# EAGLE board A20-OLINUXINO-MICRO_Rev_K (EAGLE 4.16), part 1 of 7
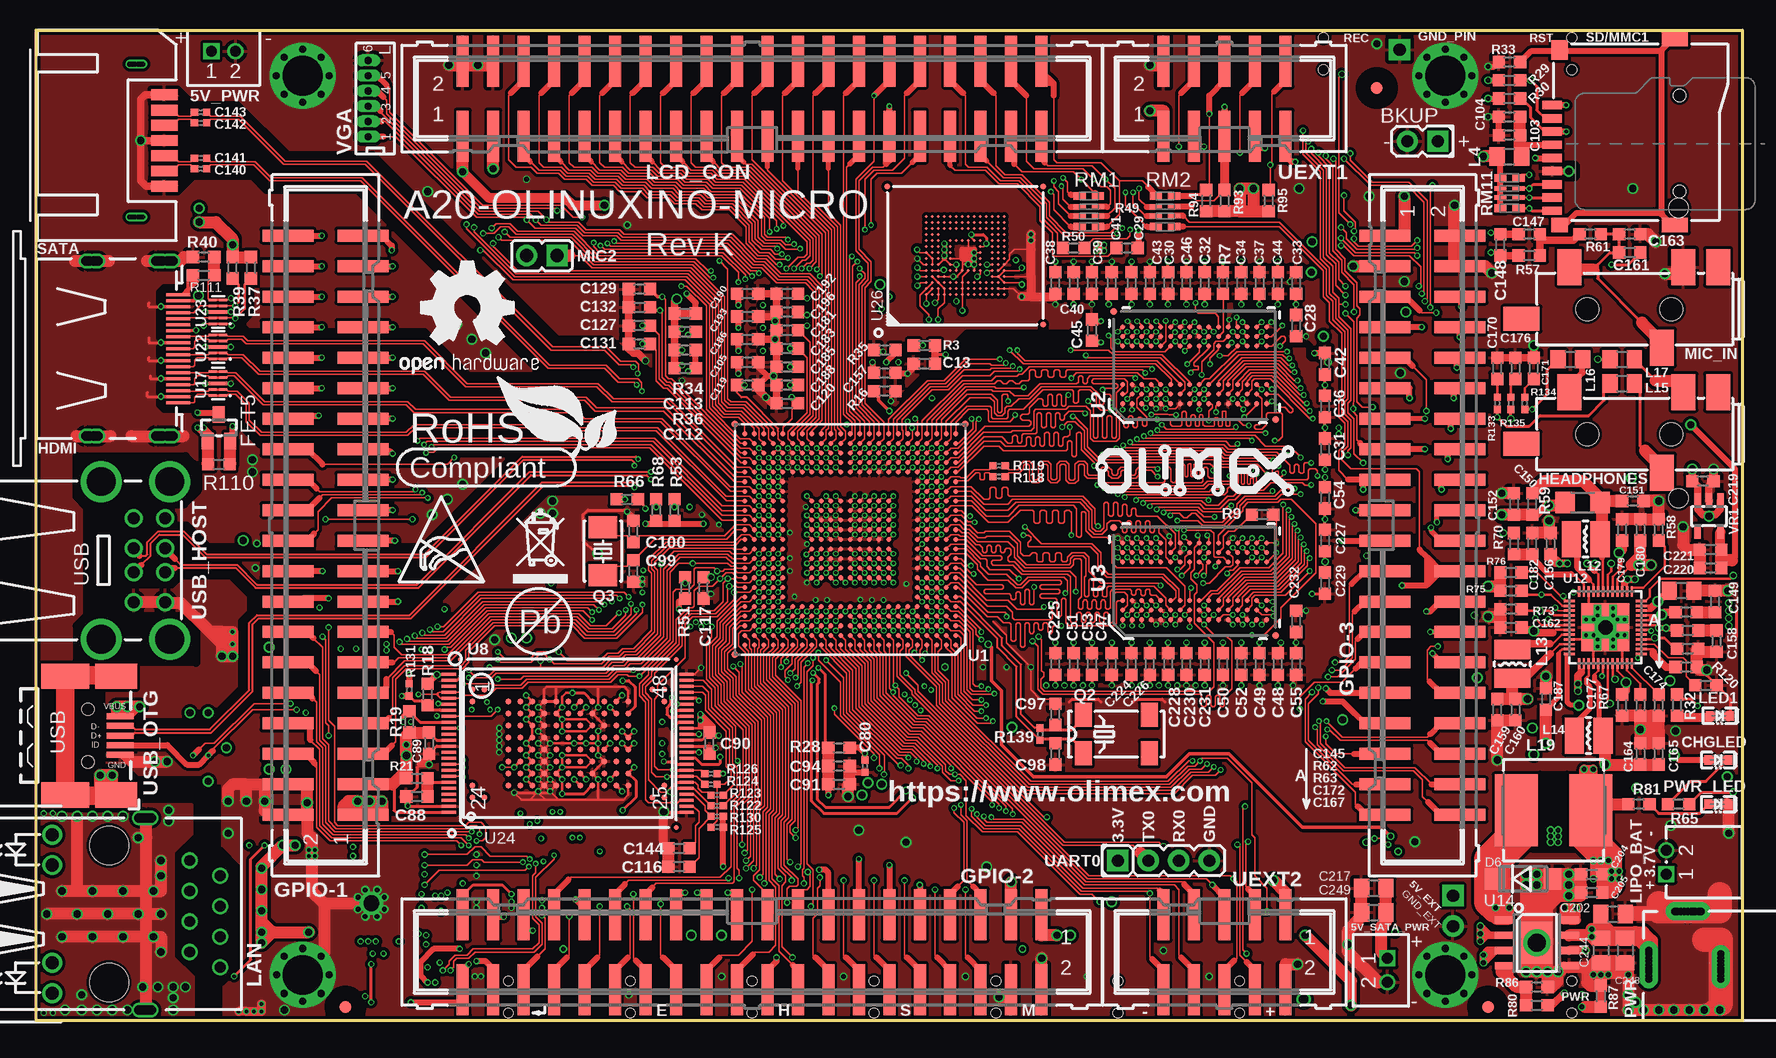
[diagram p5: board, top side]
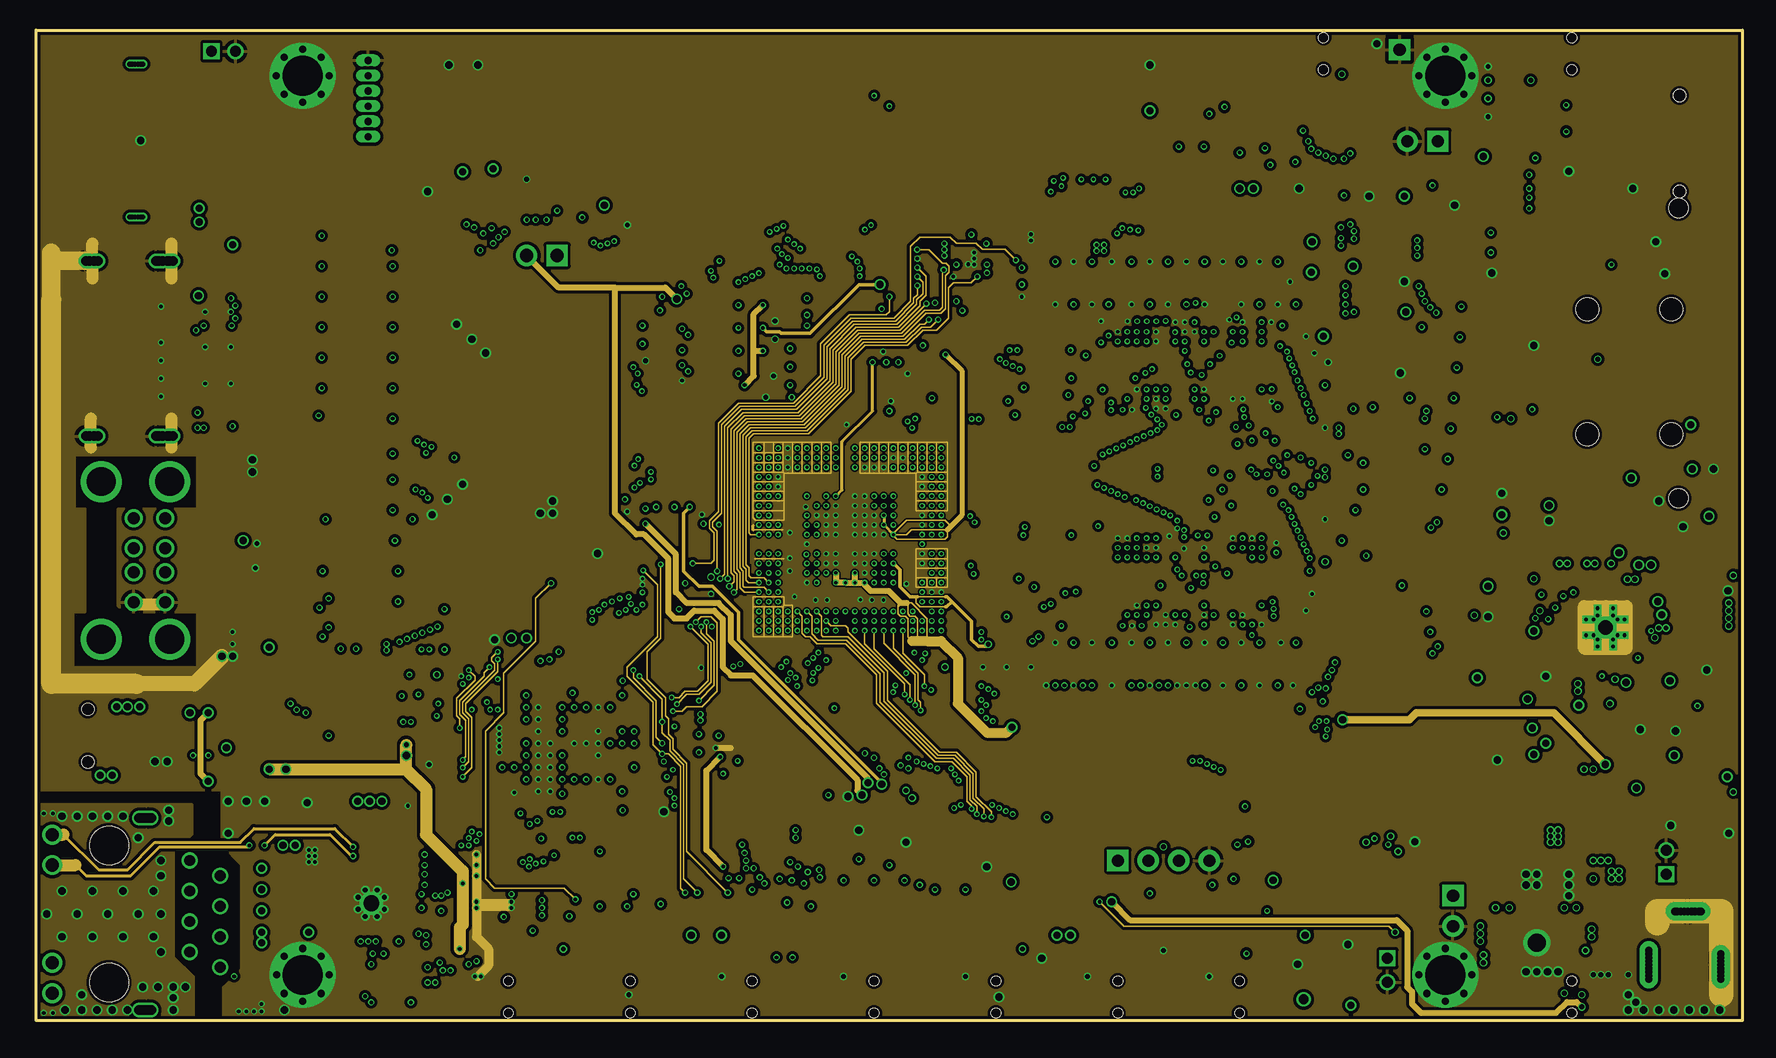
[diagram p6: board, inner layer Route2]
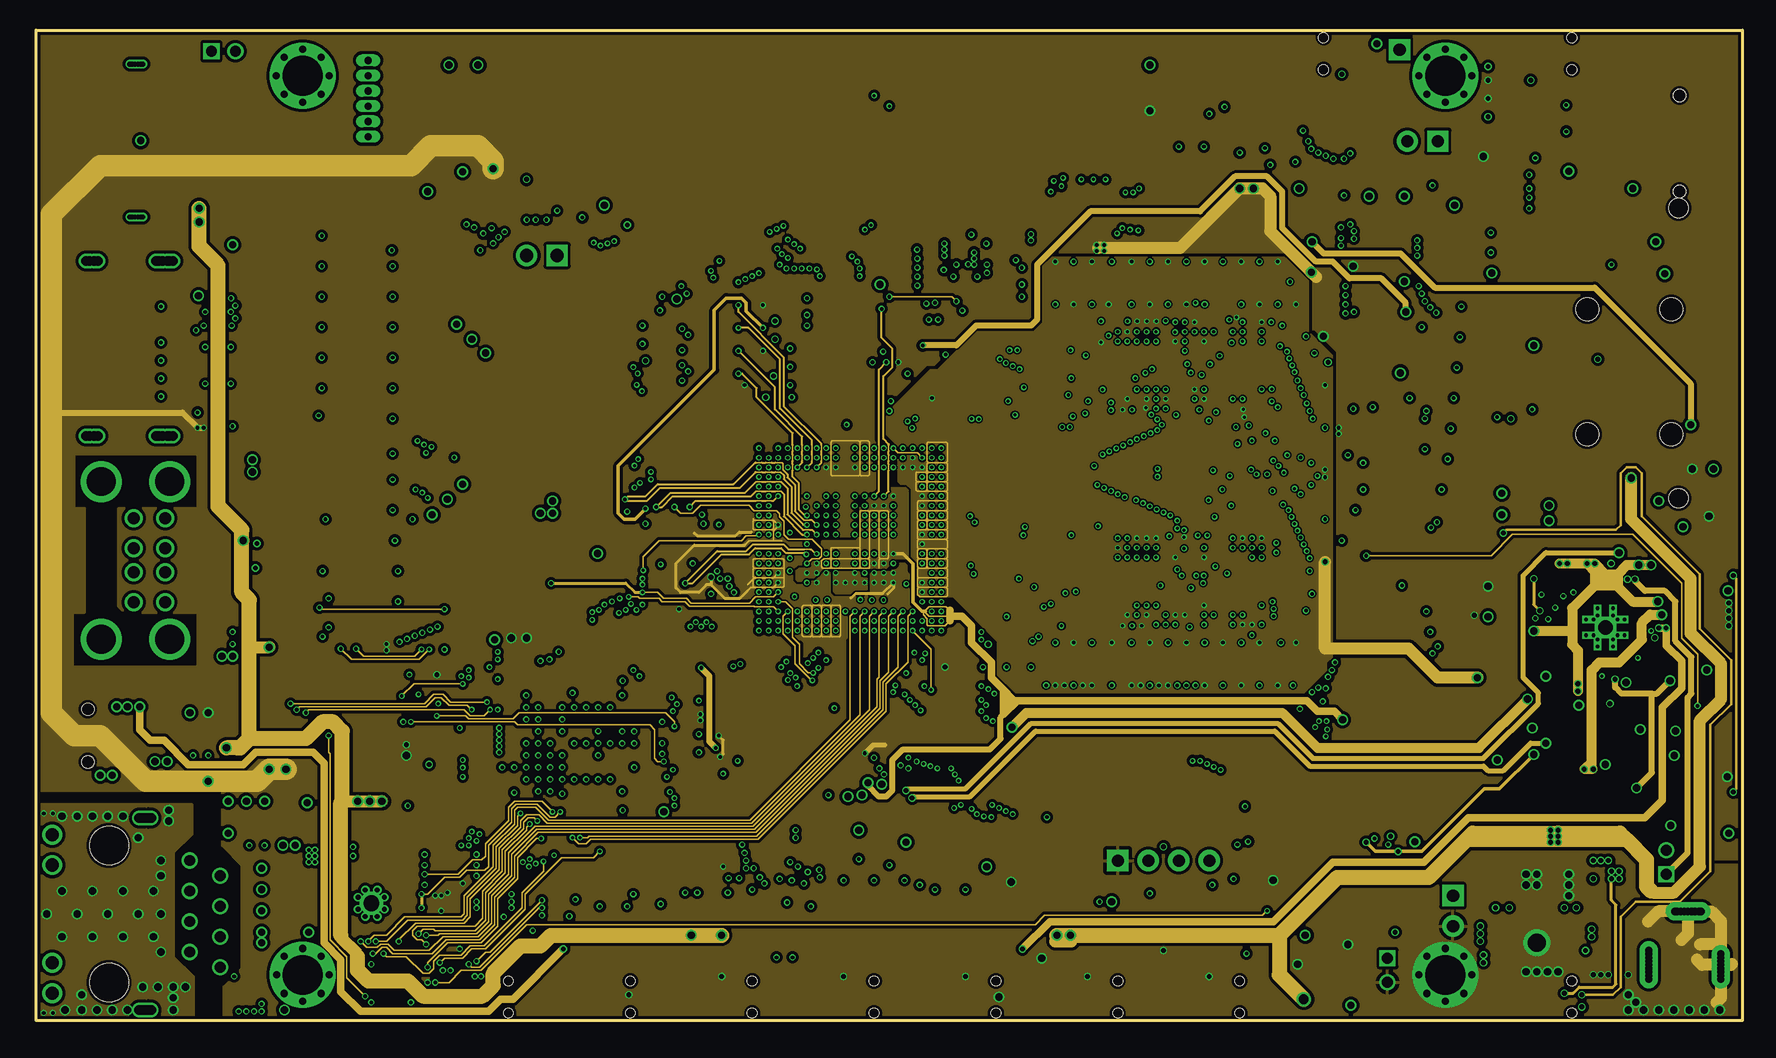
[diagram p7: board, inner layer Route15]
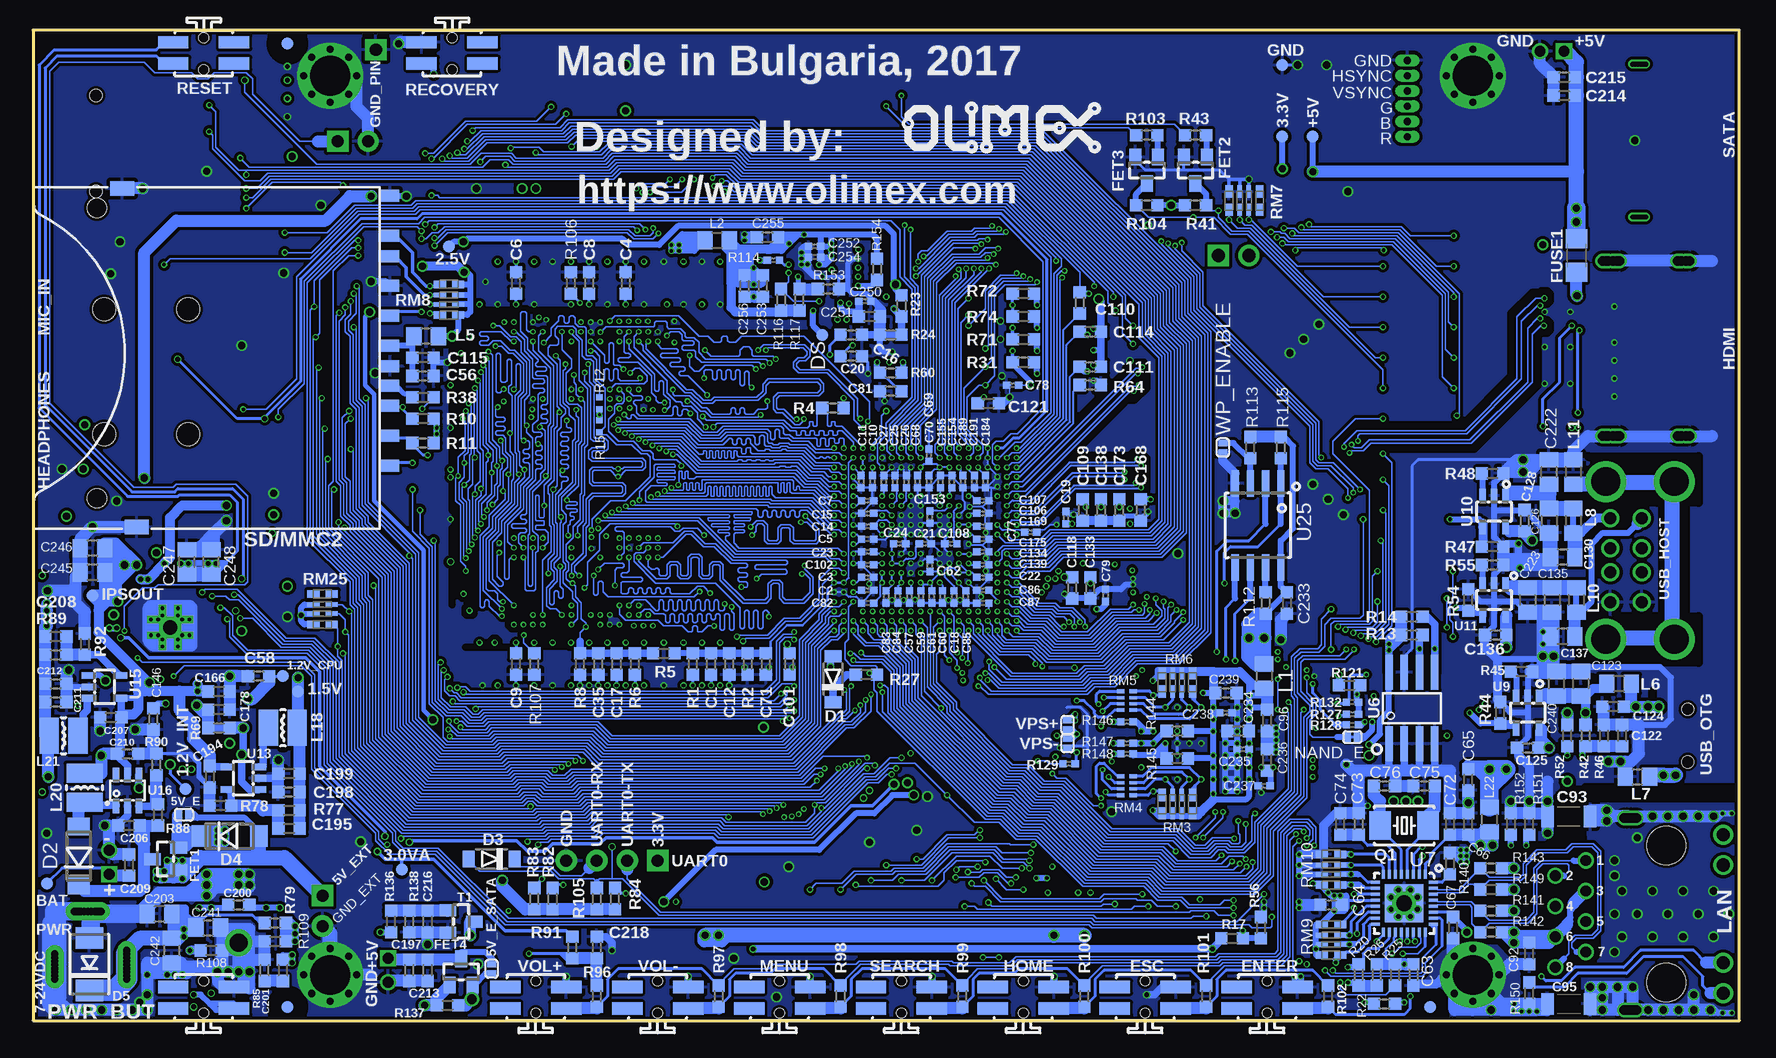
[diagram p8: board, bottom side, seen from below]

Size 142.24 x 82.55 mm. Coordinates in mm from the lower left corner, seen from the top.
Outline: 0,0 0,82.55 142.24,82.55 142.24,0 0,0
Copper layers (1+2*15+16): Top 0.035mm / dielectric 0.127mm / Route2 0.035mm / dielectric 1.1mm / Route15 0.035mm / dielectric 0.127mm / Bottom 0.035mm
Design rules "default": minimum track width 4.5mil, minimum drill 10mil, track to track 5mil, track to pad 5mil, pad to pad 5mil, via to via 5mil, smd to smd 1mil, copper to edge 10mil, drill to drill 8mil, minimum pad ring 6mil, minimum via ring 4mil, stop-mask expansion 4mil, vias tented up to drill 25mil, thermal gap 12mil
tRestrict: 311 lines
bRestrict: 296 lines

## Footprints (pad centres in the part's own frame; a part is rotated, then mirrored left to right if it is on the bottom)
TESTPAD_40-ROUND = smd 1.016 x 1.016: 1 0,0
SJ_1_SMALLER = smd 0.508 x 0.762: 1 -0.381,0; 2 0.381,0
TEST_PAD40/70/SQUARE = drill 1.016 pad 1.778 square: P$1 0,0
DW02S = drill 0.9 square: 1 -1,0 | drill 0.9 round: 2 1,0
HN1X2 = drill 1 pad 1.778 square: 1 -1.27,0 | drill 1 pad 1.778 round: 2 1.27,0
C0603_DWS = smd 1.016 x 1.016: 1 -0.889,0; 2 0.889,0
C0402_TI = smd 0.61 x 0.584: 1 -0.508,0; 2 0.508,0
C1206_5MILS_WS_ISO = smd 1.016 x 1.778: 1 -1.778,0; 2 1.778,0
C0805_5MIL_DWS = smd 1.27 x 1.524: 1 -1.016,0; 2 1.016,0
LED-0603_TEST = smd 0.8 x 0.8: A 0.762,0; C -0.762,0
SOD-123 = smd 1 x 1.4: A 1.9,0; C -1.9,0
MLL-41 = smd 1.45 x 1.8: A 2.445,0; K -2.445,0
DO214AA = smd 1.778 x 2.286: A 2.177,0; C -2.177,0
SW_TAKT3X4 = smd 2.54 x 1.016: 1_1 2.54,-0.889; 1_2 -2.54,-0.889; 2_1 2.54,0.889; 2_2 -2.54,0.889 | hole 0.8: 0,1.397; 0,-1.27
SOT23 = smd 1.4 x 1: 1 1.1,-0.95; 2 1.1,0.95; 3 -1.1,0
1206 = smd 1.6 x 1.8: 1 -1.4,0; 2 1.4,0
TESTPAD = drill 1.016 pad 1.778 round: P$1 0,0
ML40-MALE(GBH-254-SMT-40)_TEST = smd 1 x 4.25: 1 -24.13,-3.125; 2 -24.13,3.125; 3 -21.59,-3.125; 4 -21.59,3.125; 5 -19.05,-3.125; 6 -19.05,3.125; 7 -16.51,-3.125; 8 -16.51,3.125; 9 -13.97,-3.125; 10 -13.97,3.125; 11 -11.43,-3.125; 12 -11.43,3.125; 13 -8.89,-3.125; 14 -8.89,3.125; 15 -6.35,-3.125; 16 -6.35,3.125; 17 -3.81,-3.125; 18 -3.81,3.125; 19 -1.27,-3.125; 20 -1.27,3.125; 21 1.27,-3.125; 22 1.27,3.125; 23 3.81,-3.125; 24 3.81,3.125; 25 6.35,-3.125; 26 6.35,3.125; 27 8.89,-3.125; 28 8.89,3.125; 29 11.43,-3.125; 30 11.43,3.125; 31 13.97,-3.125; 32 13.97,3.125; 33 16.51,-3.125; 34 16.51,3.125; 35 19.05,-3.125; 36 19.05,3.125; 37 21.59,-3.125; 38 21.59,3.125; 39 24.13,-3.125; 40 24.13,3.125
HDMI-SWM-19_TEST = smd 0.25 x 2: 1 -4.5,-5.75; 2 -4,-5.75; 3 -3.5,-5.75; 4 -3,-5.75; 5 -2.5,-5.75; 6 -2,-5.75; 7 -1.5,-5.75; 8 -1,-5.75; 9 -0.5,-5.75; 10 0,-5.75; 11 0.5,-5.75; 12 1,-5.75; 13 1.5,-5.75; 14 2,-5.75; 15 2.5,-5.75; 16 3,-5.75; 17 3.5,-5.75; 18 4,-5.75; 19 4.5,-5.75 | drill 0.8 round: P$5 -7.3,-4.85; P$7 -7.3,1.25; P$9 7.3,1.25; P$11 7.3,-4.85; P$13 -7.3,-4.45; P$15 -7.3,1.65; P$18 7.3,1.65; P$20 7.3,-4.45; P$21 -7.3,-4.15; P$22 -7.3,-5; P$23 7.3,-5; P$24 7.3,-4.15; P$25 -7.3,-5.3; P$26 7.3,-5.3; P$27 7.3,0.95; P$28 -7.275,0.95; SH1 -7.3,-3.9; SH2 -7.3,1.95; SH3 7.3,1.95; SH4 7.3,-3.9
PJ-W47S-05D2-LF_5PIN_V2 = smd 2 x 3: 1 2.1,-0.5; 2 14.5,-0.5; 3 6.8,6.2; 5 5,-0.5 | smd 3 x 2: 4 18.5,3.8 | hole 1.9: 6,3; 13,3
L0805_5MIL_DWS = smd 1.27 x 1.524: 1 -1.016,0; 2 1.016,0
CD32 = smd 1.6 x 3: 1 -1.2,0; 2 1.2,0
8X8MM_3131 = smd 3.6 x 6: 1 -3.1,0; 2 3.1,0
RJLBC-060TC1_MILLING = drill 0.9 round: 1 -4.455,6.7; 2 -3.185,9.24; 3 -1.915,6.7; 4 -0.645,9.24; 5 0.625,6.7; 6 1.895,9.24; 7 3.165,6.7; 8 4.435,9.24 | drill 0.8 round: _1 -8,2.5; _2 -8,2.7; _3 -8,2.9; _4 -8,3.3; _5 -8,3.5; _6 8,3.5; _7 8,3.3; _8 8,2.9; _9 8,2.7; _10 8,2.5; GND1 -8,3.1; GND2 8,3.1 | drill 1.1 round: AG 4.07,-4.748; AY -6.61,-4.748; KG 6.61,-4.748; KY -4.07,-4.748 | hole 3.2: -5.715,0; 5.715,0
DW02R = drill 0.9 square: 1 -1,0 | drill 0.9 round: 2 1,0
JP1 = drill 1.1 pad 1.778 square: 1 0,-1.27 | drill 1.1 pad 1.778 round: 2 0,1.27
SJ_1_SMALLER_CLOSE_10MILS = smd 0.508 x 0.762: 1 -0.381,0; 2 0.381,0
PWR_JACK_UNI_MILLING_SMALLER_DRILLS = drill 0.6 pad 1.5 round: + -0.196,4.75; +1 -0.196,5.05; +2 -0.196,5.35; +3 -0.196,5.65; +4 -0.196,4.45; +5 -0.196,4.15; +6 -0.196,3.85; +7 -0.196,3.55; +8 -0.196,5.95; - -6.196,4.75; -1 -6.196,5.05; -2 -6.196,5.35; -3 -6.196,4.45; -4 -6.196,4.15; -5 -6.196,5.65; -6 -6.196,3.85; -8 -6.196,5.95; -- -3.446,0.3; --1 -3.746,0.3; --2 -4.046,0.3; --3 -4.346,0.3; --4 -3.146,0.3; --5 -2.846,0.3; --6 -2.546,0.3; --14 -4.546,0.3; --15 -2.346,0.3
HCX-4S = smd 1.8 x 2.4: 1 -2,0; 2 2,0
MC-306_TEST = smd 1.4 x 2: 1 -2.75,-1.6; 2 2.75,-1.6; 3 2.75,1.6; 4 -2.75,1.6
R0603_5MIL_DWS = smd 1.016 x 1.016: 1 -0.889,0; 2 0.889,0
R0402_SMALL = smd 0.5 x 0.55: 1 -0.508,0; 2 0.508,0
0603_0R = smd 1.016 x 1.016: 1 -0.889,0; 2 0.889,0
R1206_5MIL_WS = smd 1.651 x 1.778: 1 -1.46,0; 2 1.46,0
R0402_TI = smd 0.61 x 0.584: 1 -0.508,0; 2 0.508,0
R_MATRIX_4 = smd 0.635 x 1.016: 1.1 -1.27,-0.762; 1.2 -1.27,0.762; 4.1 1.27,-0.762; 4.2 1.27,0.762 | smd 0.381 x 1.016: 2.1 -0.381,-0.762; 2.2 -0.381,0.762; 3.1 0.381,-0.762; 3.2 0.381,0.762
R_MATRIX_4_0402_25X625 = smd 0.325 x 0.625: 1.1 -0.79,-0.512; 1.2 -0.79,0.512; 4.1 0.79,-0.512; 4.2 0.79,0.512 | smd 0.25 x 0.625: 2.1 -0.25,-0.512; 2.2 -0.25,0.512; 3.1 0.25,-0.512; 3.2 0.25,0.512
SATA-PWA-07-TEST = smd 0.9 x 2.2: 1 -4.25,-4.8; 2 -2.98,-4.8; 3 -1.71,-4.8; 4 -0.44,-4.8; 5 0.83,-4.8; 6 2.1,-4.8; 7 3.37,-4.8 | drill 0.4 round: P$1 -6.81,-2.35; P$2 -6.81,-2.125; P$3 -6.81,-2.6; P$4 -6.81,-1.925; P$5 -6.81,-3.025; P$11 5.93,-2.35; P$20 5.93,-2.125; P$23 5.93,-2.6; P$24 5.93,-1.925; P$26 5.93,-3.025; SH1 -6.81,-2.825; SH4 5.93,-2.825
TFC-WPAPR-08_BIGGER_CREAM = smd 1.6 x 0.7: 1 -6.994,2.25; 2 -6.994,1.15; 3 -6.994,0.05; 4 -6.994,-1.05; 5 -6.994,-2.15; 6 -6.994,-3.25; 7 -6.994,-4.35; 8 -6.994,-5.45; 9 -6.994,-6.55 | smd 1.4 x 1.2: 10 -6.369,-7.75 | smd 1.4 x 1.6: 11 -6.369,6.85 | smd 2.2 x 1.2: 12 3.231,-7.75; 13 3.231,7.75 | hole 1: 3.631,-4.95; 3.631,3.05
SD_CARD = smd 1.5 x 1: 1 -15.3,6.48; 2 -15.3,3.98; 3 -15.3,0.68; 4 -15.3,-1.03; 5 -15.3,-3.53; 6 -15.3,-6.03; 7 -15.3,-8.46; 8 -15.3,-10.16; 9 -15.3,8.98; CD -15.3,2.33; WP -15.3,-13.51 | smd 2 x 1.2: SH1 7.05,-14.1; SH2 5.85,14.1 | hole 1.6: 9.15,-12.49; 9.15,11.7
TFBGA441 = smd 0.4 x 0.4: A1 -8.8,-8.8; A2 -8.8,-8; A3 -8.8,-7.2; A4 -8.8,-6.4; A5 -8.8,-5.6; A6 -8.8,-4.8; A7 -8.8,-4; A8 -8.8,-3.2; A9 -8.8,-2.4; A10 -8.8,-1.6; A11 -8.8,-0.8; A12 -8.8,0; A13 -8.8,0.8; A14 -8.8,1.6; A15 -8.8,2.4; A16 -8.8,3.2; A17 -8.8,4; A18 -8.8,4.8; A19 -8.8,5.6; A20 -8.8,6.4; A21 -8.8,7.2; A22 -8.8,8; A23 -8.8,8.8; AA1 7.2,-8.8; AA2 7.2,-8; AA3 7.2,-7.2; AA4 7.2,-6.4; AA5 7.2,-5.6; AA6 7.2,-4.8; AA7 7.2,-4; AA8 7.2,-3.2; AA9 7.2,-2.4; AA10 7.2,-1.6; AA11 7.2,-0.8; AA12 7.2,0; AA13 7.2,0.8; AA14 7.2,1.6; AA15 7.2,2.4; AA16 7.2,3.2; AA17 7.2,4; AA18 7.2,4.8; AA19 7.2,5.6; AA20 7.2,6.4; AA21 7.2,7.2; AA22 7.2,8; AA23 7.2,8.8; AB1 8,-8.8; AB2 8,-8; AB3 8,-7.2; AB4 8,-6.4; AB5 8,-5.6; AB6 8,-4.8; AB7 8,-4; AB8 8,-3.2; AB9 8,-2.4; AB10 8,-1.6; AB11 8,-0.8; AB12 8,0; AB13 8,0.8; AB14 8,1.6; AB15 8,2.4; AB16 8,3.2; AB17 8,4; AB18 8,4.8; AB19 8,5.6; AB20 8,6.4; AB21 8,7.2; AB22 8,8; AB23 8,8.8; AC1 8.8,-8.8; AC2 8.8,-8; AC3 8.8,-7.2; AC4 8.8,-6.4; AC5 8.8,-5.6; AC6 8.8,-4.8; AC7 8.8,-4; AC8 8.8,-3.2; AC9 8.8,-2.4; AC10 8.8,-1.6; AC11 8.8,-0.8; AC12 8.8,0; AC13 8.8,0.8; AC14 8.8,1.6; AC15 8.8,2.4; AC16 8.8,3.2; AC17 8.8,4; AC18 8.8,4.8; AC19 8.8,5.6; AC20 8.8,6.4; AC21 8.8,7.2; AC22 8.8,8; AC23 8.8,8.8; B1 -8,-8.8; B2 -8,-8; B3 -8,-7.2; B4 -8,-6.4; B5 -8,-5.6; B6 -8,-4.8; B7 -8,-4; B8 -8,-3.2; B9 -8,-2.4; B10 -8,-1.6; B11 -8,-0.8; B12 -8,0; B13 -8,0.8; B14 -8,1.6; B15 -8,2.4; B16 -8,3.2; B17 -8,4; B18 -8,4.8; B19 -8,5.6; B20 -8,6.4; B21 -8,7.2; B22 -8,8; B23 -8,8.8; C1 -7.2,-8.8; C2 -7.2,-8; C3 -7.2,-7.2; C4 -7.2,-6.4; C5 -7.2,-5.6; C6 -7.2,-4.8; C7 -7.2,-4; C8 -7.2,-3.2; C9 -7.2,-2.4; C10 -7.2,-1.6; C11 -7.2,-0.8; C12 -7.2,0; C13 -7.2,0.8; C14 -7.2,1.6; C15 -7.2,2.4; C16 -7.2,3.2; C17 -7.2,4; C18 -7.2,4.8; C19 -7.2,5.6; C20 -7.2,6.4; C21 -7.2,7.2; C22 -7.2,8; C23 -7.2,8.8; D1 -6.4,-8.8; D2 -6.4,-8; D3 -6.4,-7.2; D4 -6.4,-6.4; D5 -6.4,-5.6; D6 -6.4,-4.8; D7 -6.4,-4; D8 -6.4,-3.2; D9 -6.4,-2.4; D10 -6.4,-1.6; D11 -6.4,-0.8; D12 -6.4,0; D13 -6.4,0.8; D14 -6.4,1.6; D15 -6.4,2.4; D16 -6.4,3.2; D17 -6.4,4; D18 -6.4,4.8; D19 -6.4,5.6; D20 -6.4,6.4; D21 -6.4,7.2; D22 -6.4,8; D23 -6.4,8.8; E1 -5.6,-8.8; E2 -5.6,-8; E3 -5.6,-7.2; E4 -5.6,-6.4; E5 -5.6,-5.6; E6 -5.6,-4.8; E7 -5.6,-4; E8 -5.6,-3.2; E9 -5.6,-2.4; E10 -5.6,-1.6; E11 -5.6,-0.8; E12 -5.6,0; E13 -5.6,0.8; E14 -5.6,1.6; E15 -5.6,2.4; E16 -5.6,3.2; E17 -5.6,4; E18 -5.6,4.8; E19 -5.6,5.6; E20 -5.6,6.4; E21 -5.6,7.2; E22 -5.6,8; E23 -5.6,8.8; F1 -4.8,-8.8; F2 -4.8,-8; F3 -4.8,-7.2; F4 -4.8,-6.4; F5 -4.8,-5.6; F19 -4.8,5.6; F20 -4.8,6.4; F21 -4.8,7.2; F22 -4.8,8; F23 -4.8,8.8; G1 -4,-8.8; G2 -4,-8; G3 -4,-7.2; G4 -4,-6.4; G5 -4,-5.6; G19 -4,5.6; G20 -4,6.4; G21 -4,7.2; G22 -4,8; G23 -4,8.8; H1 -3.2,-8.8; H2 -3.2,-8; H3 -3.2,-7.2; H4 -3.2,-6.4; H5 -3.2,-5.6; H8 -3.2,-3.2; H9 -3.2,-2.4; H10 -3.2,-1.6; H11 -3.2,-0.8; H12 -3.2,0; H13 -3.2,0.8; H14 -3.2,1.6; H15 -3.2,2.4; H16 -3.2,3.2; H19 -3.2,5.6; H20 -3.2,6.4; H21 -3.2,7.2; H22 -3.2,8; H23 -3.2,8.8; J1 -2.4,-8.8; J2 -2.4,-8; J3 -2.4,-7.2; J4 -2.4,-6.4; J5 -2.4,-5.6; J8 -2.4,-3.2; J9 -2.4,-2.4; J10 -2.4,-1.6; J11 -2.4,-0.8; J12 -2.4,0; J13 -2.4,0.8; J14 -2.4,1.6; J15 -2.4,2.4; J16 -2.4,3.2; J19 -2.4,5.6; J20 -2.4,6.4; J21 -2.4,7.2; J22 -2.4,8; J23 -2.4,8.8; K1 -1.6,-8.8; K2 -1.6,-8; K3 -1.6,-7.2; K4 -1.6,-6.4; K5 -1.6,-5.6; K8 -1.6,-3.2; K9 -1.6,-2.4; K10 -1.6,-1.6; K11 -1.6,-0.8; K12 -1.6,0; K13 -1.6,0.8; K14 -1.6,1.6; K15 -1.6,2.4; K16 -1.6,3.2; K19 -1.6,5.6; K20 -1.6,6.4; K21 -1.6,7.2; K22 -1.6,8; K23 -1.6,8.8; L1 -0.8,-8.8; L2 -0.8,-8; L3 -0.8,-7.2; L4 -0.8,-6.4; L5 -0.8,-5.6; L8 -0.8,-3.2; L9 -0.8,-2.4; L10 -0.8,-1.6; L11 -0.8,-0.8; L12 -0.8,0; L13 -0.8,0.8; L14 -0.8,1.6; L15 -0.8,2.4; L16 -0.8,3.2; L19 -0.8,5.6; L20 -0.8,6.4; L21 -0.8,7.2; L22 -0.8,8; L23 -0.8,8.8; M1 0,-8.8; M2 0,-8; M3 0,-7.2; M4 0,-6.4; M5 0,-5.6; M8 0,-3.2; M9 0,-2.4; M10 0,-1.6; M11 0,-0.8; M12 0,0; M13 0,0.8; M14 0,1.6; M15 0,2.4; M16 0,3.2; M19 0,5.6; M20 0,6.4; M21 0,7.2; M22 0,8; M23 0,8.8; N1 0.8,-8.8; N2 0.8,-8; N3 0.8,-7.2; N4 0.8,-6.4; N5 0.8,-5.6; N8 0.8,-3.2; N9 0.8,-2.4; N10 0.8,-1.6; N11 0.8,-0.8; N12 0.8,0; N13 0.8,0.8; N14 0.8,1.6; N15 0.8,2.4; N16 0.8,3.2; N19 0.8,5.6; N20 0.8,6.4; N21 0.8,7.2; N22 0.8,8; N23 0.8,8.8; P1 1.6,-8.8; P2 1.6,-8; P3 1.6,-7.2; P4 1.6,-6.4; P5 1.6,-5.6; P8 1.6,-3.2; P9 1.6,-2.4; P10 1.6,-1.6; P11 1.6,-0.8; P12 1.6,0; P13 1.6,0.8; P14 1.6,1.6; P15 1.6,2.4; P16 1.6,3.2; P19 1.6,5.6; P20 1.6,6.4; P21 1.6,7.2; P22 1.6,8; P23 1.6,8.8; R1 2.4,-8.8; R2 2.4,-8; R3 2.4,-7.2; R4 2.4,-6.4; R5 2.4,-5.6; R8 2.4,-3.2; R9 2.4,-2.4; R10 2.4,-1.6; R11 2.4,-0.8; R12 2.4,0; R13 2.4,0.8; R14 2.4,1.6; R15 2.4,2.4; R16 2.4,3.2; R19 2.4,5.6; R20 2.4,6.4; R21 2.4,7.2; R22 2.4,8; R23 2.4,8.8; T1 3.2,-8.8; T2 3.2,-8; T3 3.2,-7.2; T4 3.2,-6.4; T5 3.2,-5.6; T8 3.2,-3.2; T9 3.2,-2.4; T10 3.2,-1.6; T11 3.2,-0.8; T12 3.2,0; T13 3.2,0.8; T14 3.2,1.6; T15 3.2,2.4; T16 3.2,3.2; T19 3.2,5.6; T20 3.2,6.4; T21 3.2,7.2; T22 3.2,8; T23 3.2,8.8; U1 4,-8.8; U2 4,-8; U3 4,-7.2; U4 4,-6.4; U5 4,-5.6; U19 4,5.6; U20 4,6.4; U21 4,7.2; U22 4,8; U23 4,8.8; V1 4.8,-8.8; V2 4.8,-8; V3 4.8,-7.2; V4 4.8,-6.4; V5 4.8,-5.6; V19 4.8,5.6; V20 4.8,6.4; V21 4.8,7.2; V22 4.8,8; V23 4.8,8.8; W1 5.6,-8.8; W2 5.6,-8; W3 5.6,-7.2; W4 5.6,-6.4; W5 5.6,-5.6; W6 5.6,-4.8; W7 5.6,-4; W8 5.6,-3.2; W9 5.6,-2.4; W10 5.6,-1.6; W11 5.6,-0.8; W12 5.6,0; W13 5.6,0.8; W14 5.6,1.6; W15 5.6,2.4; W16 5.6,3.2; W17 5.6,4; W18 5.6,4.8; W19 5.6,5.6; W20 5.6,6.4; W21 5.6,7.2; W22 5.6,8; W23 5.6,8.8; Y1 6.4,-8.8; Y2 6.4,-8; Y3 6.4,-7.2; Y4 6.4,-6.4; Y5 6.4,-5.6; Y6 6.4,-4.8; Y7 6.4,-4; Y8 6.4,-3.2; Y9 6.4,-2.4; Y10 6.4,-1.6; Y11 6.4,-0.8; Y12 6.4,0; Y13 6.4,0.8; Y14 6.4,1.6; Y15 6.4,2.4; Y16 6.4,3.2; Y17 6.4,4; Y18 6.4,4.8; Y19 6.4,5.6; Y20 6.4,6.4; Y21 6.4,7.2; Y22 6.4,8; Y23 6.4,8.8 | smd 0.6 x 0.6: FID1 -9.6,9.6; FID2 9.6,9.6; FID3 9.6,-9.6
FBGA96_MEM = smd 0.4 x 0.4: A1 -6,-3.2; A2 -6,-2.4; A3 -6,-1.6; A7 -6,1.6; A8 -6,2.4; A9 -6,3.2; B1 -5.2,-3.2; B2 -5.2,-2.4; B3 -5.2,-1.6; B7 -5.2,1.6; B8 -5.2,2.4; B9 -5.2,3.2; C1 -4.4,-3.2; C2 -4.4,-2.4; C3 -4.4,-1.6; C7 -4.4,1.6; C8 -4.4,2.4; C9 -4.4,3.2; D1 -3.6,-3.2; D2 -3.6,-2.4; D3 -3.6,-1.6; D7 -3.6,1.6; D8 -3.6,2.4; D9 -3.6,3.2; E1 -2.8,-3.2; E2 -2.8,-2.4; E3 -2.8,-1.6; E7 -2.8,1.6; E8 -2.8,2.4; E9 -2.8,3.2; F1 -2,-3.2; F2 -2,-2.4; F3 -2,-1.6; F7 -2,1.6; F8 -2,2.4; F9 -2,3.2; G1 -1.2,-3.2; G2 -1.2,-2.4; G3 -1.2,-1.6; G7 -1.2,1.6; G8 -1.2,2.4; G9 -1.2,3.2; H1 -0.4,-3.2; H2 -0.4,-2.4; H3 -0.4,-1.6; H7 -0.4,1.6; H8 -0.4,2.4; H9 -0.4,3.2; J1 0.4,-3.2; J2 0.4,-2.4; J3 0.4,-1.6; J7 0.4,1.6; J8 0.4,2.4; J9 0.4,3.2; K1 1.2,-3.2; K2 1.2,-2.4; K3 1.2,-1.6; K7 1.2,1.6; K8 1.2,2.4; K9 1.2,3.2; L1 2,-3.2; L2 2,-2.4; L3 2,-1.6; L7 2,1.6; L8 2,2.4; L9 2,3.2; M1 2.8,-3.2; M2 2.8,-2.4; M3 2.8,-1.6; M7 2.8,1.6; M8 2.8,2.4; M9 2.8,3.2; N1 3.6,-3.2; N2 3.6,-2.4; N3 3.6,-1.6; N7 3.6,1.6; N8 3.6,2.4; N9 3.6,3.2; P1 4.4,-3.2; P2 4.4,-2.4; P3 4.4,-1.6; P7 4.4,1.6; P8 4.4,2.4; P9 4.4,3.2; R1 5.2,-3.2; R2 5.2,-2.4; R3 5.2,-1.6; R7 5.2,1.6; R8 5.2,2.4; R9 5.2,3.2; T1 6,-3.2; T2 6,-2.4; T3 6,-1.6; T7 6,1.6; T8 6,2.4; T9 6,3.2 | smd 0.6 x 0.6: FID1 6.75,-4.5; FID2 -6.75,4.5
FIDUCIAL-1X3 = smd 1 x 1: 1 0,0
SO-08MN = smd 0.61 x 2.921: 1 -1.905,-2.981; 2 -0.635,-2.981; 3 0.635,-2.981; 4 1.905,-2.981; 5 1.905,2.981; 6 0.635,2.981; 7 -0.635,2.981; 8 -1.905,2.981
QFN-32(DRILLS) = smd 0.25 x 0.75: 1 -1.75,-2.425; 2 -1.25,-2.425; 3 -0.75,-2.425; 4 -0.25,-2.425; 5 0.25,-2.425; 6 0.75,-2.425; 7 1.25,-2.425; 8 1.75,-2.425; 17 1.75,2.425; 18 1.25,2.425; 19 0.75,2.425; 20 0.25,2.425; 21 -0.25,2.425; 22 -0.75,2.425; 23 -1.25,2.425; 24 -1.75,2.425 | smd 0.75 x 0.25: 9 2.425,-1.75; 10 2.425,-1.25; 11 2.425,-0.75; 12 2.425,-0.25; 13 2.425,0.25; 14 2.425,0.75; 15 2.425,1.25; 16 2.425,1.75; 25 -2.425,1.75; 26 -2.425,1.25; 27 -2.425,0.75; 28 -2.425,0.25; 29 -2.425,-0.25; 30 -2.425,-0.75; 31 -2.425,-1.25; 32 -2.425,-1.75 | drill 1.3 round: EP1 0,0 | drill 0.4 round: EP2 -0.5,1.1; EP3 0.5,1.1; EP4 1.1,0.5; EP5 1.1,-0.5; EP6 0.5,-1.1; EP7 -0.5,-1.1; EP8 -1.1,-0.5; EP9 -1.1,0.5 | smd 3.2 x 3.2: EXP_PAD 0,0
TSOP48 = smd 1.2 x 0.25: 1 -9.9,5.75; 2 -9.9,5.25; 3 -9.9,4.75; 4 -9.9,4.25; 5 -9.9,3.75; 6 -9.9,3.25; 7 -9.9,2.75; 8 -9.9,2.25; 9 -9.9,1.75; 10 -9.9,1.25; 11 -9.9,0.75; 12 -9.9,0.25; 13 -9.9,-0.25; 14 -9.9,-0.75; 15 -9.9,-1.25; 16 -9.9,-1.75; 17 -9.9,-2.25; 18 -9.9,-2.75; 19 -9.9,-3.25; 20 -9.9,-3.75; 21 -9.9,-4.25; 22 -9.9,-4.75; 23 -9.9,-5.25; 24 -9.9,-5.75; 25 9.9,-5.75; 26 9.9,-5.25; 27 9.9,-4.75; 28 9.9,-4.25; 29 9.9,-3.75; 30 9.9,-3.25; 31 9.9,-2.75; 32 9.9,-2.25; 33 9.9,-1.75; 34 9.9,-1.25; 35 9.9,-0.75; 36 9.9,-0.25; 37 9.9,0.25; 38 9.9,0.75; 39 9.9,1.25; 40 9.9,1.75; 41 9.9,2.25; 42 9.9,2.75; 43 9.9,3.25; 44 9.9,3.75; 45 9.9,4.25; 46 9.9,4.75; 47 9.9,5.25; 48 9.9,5.75
SOT23-5 = smd 1.2 x 0.55: 1 1.3,-0.95; 2 1.3,0; 3 1.3,0.95; 4 -1.3,0.95; 5 -1.3,-0.95
QFN48 = smd 0.2 x 0.9: 1 -2.2,-3; 2 -1.8,-3; 3 -1.4,-3; 4 -1,-3; 5 -0.6,-3; 6 -0.2,-3; 7 0.2,-3; 8 0.6,-3; 9 1,-3; 10 1.4,-3; 11 1.8,-3; 12 2.2,-3; 25 2.2,3; 26 1.8,3; 27 1.4,3; 28 1,3; 29 0.6,3; 30 0.2,3; 31 -0.2,3; 32 -0.6,3; 33 -1,3; 34 -1.4,3; 35 -1.8,3; 36 -2.2,3 | smd 0.9 x 0.2: 13 3,-2.2; 14 3,-1.8; 15 3,-1.4; 16 3,-1; 17 3,-0.6; 18 3,-0.2; 19 3,0.2; 20 3,0.6; 21 3,1; 22 3,1.4; 23 3,1.8; 24 3,2.2; 37 -3,2.2; 38 -3,1.8; 39 -3,1.4; 40 -3,1; 41 -3,0.6; 42 -3,0.2; 43 -3,-0.2; 44 -3,-0.6; 45 -3,-1; 46 -3,-1.4; 47 -3,-1.8; 48 -3,-2.2 | drill 1.2 pad 1.422 square: N1 0,0 | drill 0.3 pad 0.4 square: N2 -1.6,0.65; N3 -1,0.65; N4 -1.6,-0.65; N5 -1,-0.65; N6 -0.65,-1.6; N7 -0.65,-1; N8 0.65,-1.6; N9 0.65,-1; N10 1.6,-0.65; N11 1,-0.65; N12 1.6,0.65; N13 1,0.65; N14 0.65,1.6; N15 0.65,1; N16 -0.65,1.6; N17 -0.65,1 | smd 4 x 4: VSS 0,0
SOIC8E = smd 0.61 x 1.6: 1 -1.905,-2.7; 2 -0.635,-2.7; 3 0.635,-2.7; 4 1.905,-2.7; 5 1.905,2.7; 6 0.635,2.7; 7 -0.635,2.7; 8 -1.905,2.7 | smd 3.51 x 2.62: EP 0,0 | drill 1.5 round: EP1 0,0
SOT23-6 = smd 1.2 x 0.55: 1 1.3,-0.95; 2 1.3,0; 3 1.3,0.95; 4 -1.3,0.95; 5 -1.3,0; 6 -1.3,-0.95
SLP2510P8_TEST = smd 0.2 x 0.675: 1 -1,-0.438; 2 -0.5,-0.438; 4 0.5,-0.438; 5 1,-0.438; 6 1,0.438; 7 0.5,0.438; 9 -0.5,0.438; 10 -1,0.438 | smd 0.3 x 0.775: 3 0,-0.388; 8 0,0.388
TBGA100 = smd 0.5 x 0.5: A1 -8,-4.5; A2 -8,-3.5; A9 -8,3.5; A10 -8,4.5; B1 -7,-4.5; B10 -7,4.5; D2 -5,-3.5; D3 -5,-2.5; D4 -5,-1.5; D5 -5,-0.5; D6 -5,0.5; D7 -5,1.5; D8 -5,2.5; D9 -5,3.5; E2 -4,-3.5; E3 -4,-2.5; E4 -4,-1.5; E5 -4,-0.5; E6 -4,0.5; E7 -4,1.5; E8 -4,2.5; E9 -4,3.5; F2 -3,-3.5; F3 -3,-2.5; F4 -3,-1.5; F5 -3,-0.5; F6 -3,0.5; F7 -3,1.5; F8 -3,2.5; F9 -3,3.5; G2 -2,-3.5; G3 -2,-2.5; G4 -2,-1.5; G5 -2,-0.5; G6 -2,0.5; G7 -2,1.5; G8 -2,2.5; G9 -2,3.5; H2 -1,-3.5; H3 -1,-2.5; H4 -1,-1.5; H5 -1,-0.5; H6 -1,0.5; H7 -1,1.5; H8 -1,2.5; H9 -1,3.5; J2 0,-3.5; J3 0,-2.5; J4 0,-1.5; J5 0,-0.5; J6 0,0.5; J7 0,1.5; J8 0,2.5; J9 0,3.5; K2 1,-3.5; K3 1,-2.5; K4 1,-1.5; K5 1,-0.5; K6 1,0.5; K7 1,1.5; K8 1,2.5; K9 1,3.5; L2 2,-3.5; L3 2,-2.5; L4 2,-1.5; L5 2,-0.5; L6 2,0.5; L7 2,1.5; L8 2,2.5; L9 2,3.5; M2 3,-3.5; M3 3,-2.5; M4 3,-1.5; M5 3,-0.5; M6 3,0.5; M7 3,1.5; M8 3,2.5; M9 3,3.5; N2 4,-3.5; N3 4,-2.5; N4 4,-1.5; N5 4,-0.5; N6 4,0.5; N7 4,1.5; N8 4,2.5; N9 4,3.5; P2 5,-3.5; P3 5,-2.5; P4 5,-1.5; P5 5,-0.5; P6 5,0.5; P7 5,1.5; P8 5,2.5; P9 5,3.5; T1 7,-4.5; T10 7,4.5; U1 8,-4.5; U2 8,-3.5; U9 8,3.5; U10 8,4.5 | smd 0.4 x 0.4: FID1 9,-7; FID2 9,7; FID3 -9,7
SO-8-BIG = smd 0.6 x 2.2: 1 -1.905,-3.5; 2 -0.635,-3.5; 3 0.635,-3.5; 4 1.905,-3.5; 5 1.905,3.5; 6 0.635,3.5; 7 -0.635,3.5; 8 -1.905,3.5
FBGA153 = smd 0.25 x 0.25: A1 -3.25,-3.25; A2 -3.25,-2.75; A3 -3.25,-2.25; A4 -3.25,-1.75; A5 -3.25,-1.25; A6 -3.25,-0.75; A7 -3.25,-0.25; A8 -3.25,0.25; A9 -3.25,0.75; A10 -3.25,1.25; A11 -3.25,1.75; A12 -3.25,2.25; A13 -3.25,2.75; A14 -3.25,3.25; B1 -2.75,-3.25; B2 -2.75,-2.75; B3 -2.75,-2.25; B4 -2.75,-1.75; B5 -2.75,-1.25; B6 -2.75,-0.75; B7 -2.75,-0.25; B8 -2.75,0.25; B9 -2.75,0.75; B10 -2.75,1.25; B11 -2.75,1.75; B12 -2.75,2.25; B13 -2.75,2.75; B14 -2.75,3.25; C1 -2.25,-3.25; C2 -2.25,-2.75; C3 -2.25,-2.25; C4 -2.25,-1.75; C5 -2.25,-1.25; C6 -2.25,-0.75; C7 -2.25,-0.25; C8 -2.25,0.25; C9 -2.25,0.75; C10 -2.25,1.25; C11 -2.25,1.75; C12 -2.25,2.25; C13 -2.25,2.75; C14 -2.25,3.25; D1 -1.75,-3.25; D2 -1.75,-2.75; D3 -1.75,-2.25; D4 -1.75,-1.75; D12 -1.75,2.25; D13 -1.75,2.75; D14 -1.75,3.25; E1 -1.25,-3.25; E2 -1.25,-2.75; E3 -1.25,-2.25; E5 -1.25,-1.25; E6 -1.25,-0.75; E7 -1.25,-0.25; E8 -1.25,0.25; E9 -1.25,0.75; E10 -1.25,1.25; E12 -1.25,2.25; E13 -1.25,2.75; E14 -1.25,3.25; F1 -0.75,-3.25; F2 -0.75,-2.75; F3 -0.75,-2.25; F5 -0.75,-1.25; F10 -0.75,1.25; F12 -0.75,2.25; F13 -0.75,2.75; F14 -0.75,3.25; G1 -0.25,-3.25; G2 -0.25,-2.75; G3 -0.25,-2.25; G5 -0.25,-1.25; G10 -0.25,1.25; G12 -0.25,2.25; G13 -0.25,2.75; G14 -0.25,3.25; H1 0.25,-3.25; H2 0.25,-2.75; H3 0.25,-2.25; H5 0.25,-1.25; H10 0.25,1.25; H12 0.25,2.25; H13 0.25,2.75; H14 0.25,3.25; J1 0.75,-3.25; J2 0.75,-2.75; J3 0.75,-2.25; J5 0.75,-1.25; J10 0.75,1.25; J12 0.75,2.25; J13 0.75,2.75; J14 0.75,3.25; K1 1.25,-3.25; K2 1.25,-2.75; K3 1.25,-2.25; K5 1.25,-1.25; K6 1.25,-0.75; K7 1.25,-0.25; K8 1.25,0.25; K9 1.25,0.75; K10 1.25,1.25; K12 1.25,2.25; K13 1.25,2.75; K14 1.25,3.25; L1 1.75,-3.25; L2 1.75,-2.75; L3 1.75,-2.25; L12 1.75,2.25; L13 1.75,2.75; L14 1.75,3.25; M1 2.25,-3.25; M2 2.25,-2.75; M3 2.25,-2.25; M4 2.25,-1.75; M5 2.25,-1.25; M6 2.25,-0.75; M7 2.25,-0.25; M8 2.25,0.25; M9 2.25,0.75; M10 2.25,1.25; M11 2.25,1.75; M12 2.25,2.25; M13 2.25,2.75; M14 2.25,3.25; N1 2.75,-3.25; N2 2.75,-2.75; N3 2.75,-2.25; N4 2.75,-1.75; N5 2.75,-1.25; N6 2.75,-0.75; N7 2.75,-0.25; N8 2.75,0.25; N9 2.75,0.75; N10 2.75,1.25; N11 2.75,1.75; N12 2.75,2.25; N13 2.75,2.75; N14 2.75,3.25; P1 3.25,-3.25; P2 3.25,-2.75; P3 3.25,-2.25; P4 3.25,-1.75; P5 3.25,-1.25; P6 3.25,-0.75; P7 3.25,-0.25; P8 3.25,0.25; P9 3.25,0.75; P10 3.25,1.25; P11 3.25,1.75; P12 3.25,2.25; P13 3.25,2.75; P14 3.25,3.25 | smd 0.5 x 0.5: FID1 -6.5,5.75; FID2 6.5,5.75; FID3 6.5,-5.75
HN1X4 = drill 1 pad 1.778 square: 1 -3.81,0 | drill 1 pad 1.778 round: 2 -1.27,0; 3 1.27,0; 4 3.81,0
ML10-MALE(GBH-254-SMT-10)_TEST = smd 1 x 4.25: 1 -5.08,-3.125; 2 -5.08,3.125; 3 -2.54,-3.125; 4 -2.54,3.125; 5 0,-3.125; 6 0,3.125; 7 2.54,-3.125; 8 2.54,3.125; 9 5.08,-3.125; 10 5.08,3.125
USB_TWO_LEVEL = drill 1 round: 1.1 -3.5,2.62; 1.2 -1,2.62; 1.3 1,2.62; 1.4 3.5,2.62; 2.1 -3.5,0; 2.2 -1,0; 2.3 1,0; 2.4 3.5,0 | drill 2.4 round: GND1 -6.57,-2.7; GND2 6.57,-2.7; GND3 6.57,3; GND4 -6.57,3
USB_MINI_9PIN = smd 2.25 x 0.5: D+ -3.722,0; D- -3.722,-0.8; GND -3.722,1.6; ID -3.722,0.8; VBUS -3.722,-1.6 | smd 4 x 2.1: GND1 0.884,-4.95; GND3 0.884,4.95 | smd 3.5 x 2.1: GND2 -3.366,-4.95; GND4 -3.366,4.95 | hole 1: -1.016,-2.2; -1.016,2.2
CON1.27MM-6-SMALL_ICSP = drill 0.6 pad 1.016 long: 1 -3.175,0; 2 -1.905,0; 3 -0.635,0; 4 0.635,0; 5 1.905,0; 6 3.175,0
SOT-23-5 = smd 1.2 x 0.55: 1 1.3,-0.95; 2 1.3,0; 3 1.3,0.95; 4 -1.3,0.95; 5 -1.3,-0.95